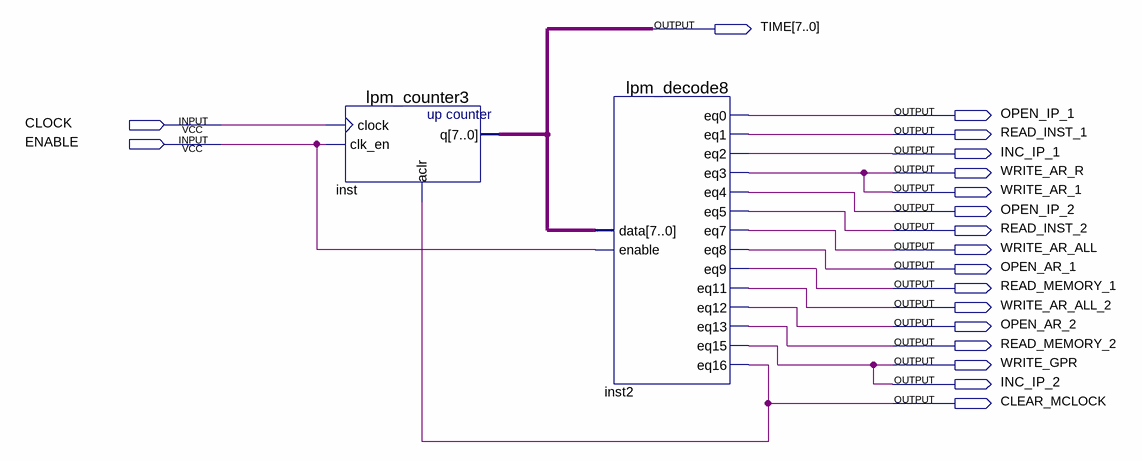
[diagram p0: schematic sheet]
// Quartus schematic MOV_REG_lADRl.bdf as structural Verilog: 2 symbols, 19 pins
module MOV_REG_lADRl (
  input  CLOCK,
  input  ENABLE,
  output [7:0] TIME,
  output OPEN_IP_1,
  output READ_INST_1,
  output INC_IP_1,
  output WRITE_AR_R,
  output WRITE_AR_1,
  output OPEN_IP_2,
  output READ_INST_2,
  output WRITE_AR_ALL,
  output OPEN_AR_1,
  output READ_MEMORY_1,
  output WRITE_AR_ALL_2,
  output OPEN_AR_2,
  output READ_MEMORY_2,
  output WRITE_GPR,
  output INC_IP_2,
  output CLEAR_MCLOCK
);

  lpm_counter3 inst (.clock(CLOCK), .clk_en(ENABLE), .aclr(CLEAR_MCLOCK), .q(TIME));
  lpm_decode8 inst2 (
    .data(TIME), .enable(ENABLE), .eq0(OPEN_IP_1), .eq1(READ_INST_1), .eq2(INC_IP_1), .eq3(WRITE_AR_1),
    .eq4(OPEN_IP_2), .eq5(READ_INST_2), .eq7(WRITE_AR_ALL), .eq8(OPEN_AR_1), .eq9(READ_MEMORY_1),
    .eq11(WRITE_AR_ALL_2), .eq12(OPEN_AR_2), .eq13(READ_MEMORY_2), .eq15(INC_IP_2), .eq16(CLEAR_MCLOCK));

  assign WRITE_AR_R = WRITE_AR_1;
  assign WRITE_GPR = INC_IP_2;
endmodule
